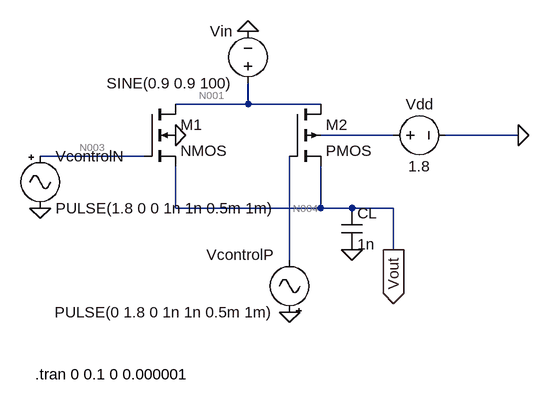
[diagram p0: schematic Lab 7 Fig 1c.asc]
Lab 7 Fig 1c.asc, the LTspice schematic file:
Version 4
SHEET 1 880 680
WIRE 224 112 224 80
WIRE 224 112 112 112
WIRE 336 112 224 112
WIRE 448 160 336 160
WIRE 640 160 528 160
WIRE 64 192 -96 192
WIRE 112 272 112 208
WIRE 336 272 336 208
WIRE 336 272 112 272
WIRE 384 272 336 272
WIRE 448 272 384 272
WIRE 448 336 448 272
WIRE 288 352 288 192
FLAG 224 0 0
FLAG 448 336 Vout
IOPIN 448 336 Out
FLAG -96 272 0
FLAG 288 432 0
FLAG 384 336 0
FLAG 112 160 0
FLAG 640 160 0
SYMBOL nmos4 64 112 R0
SYMATTR InstName M1
SYMBOL pmos4 288 112 R0
SYMATTR InstName M2
SYMBOL Misc\\signal -96 176 R0
WINDOW 123 0 0 Left 0
WINDOW 39 0 0 Left 0
SYMATTR InstName VcontrolN
SYMATTR Value PULSE(1.8 0 0 1n 1n 0.5m 1m)
SYMBOL Misc\\signal 288 448 R180
WINDOW 0 24 104 Left 2
WINDOW 3 24 16 Left 2
SYMATTR InstName VcontrolP
SYMATTR Value PULSE(0 1.8 0 1n 1n 0.5m 1m)
SYMBOL cap 368 272 R0
SYMATTR InstName CL
SYMATTR Value 1n
SYMBOL voltage 432 160 R270
WINDOW 0 32 56 VTop 2
WINDOW 3 -32 56 VBottom 2
SYMATTR InstName Vdd
SYMATTR Value 1.8
SYMBOL voltage 224 96 R180
WINDOW 0 24 96 Left 2
WINDOW 3 24 16 Left 2
SYMATTR InstName Vin
SYMATTR Value SINE(0.9 0.9 100)
TEXT -104 528 Left 2 !.tran 0 0.1 0 0.000001

The netlist it stands for:
* Lab 7 Fig 1c.asc
M1 N001 N003 Vout 0 NMOS
M2 N001 N004 Vout N002 PMOS
VcontrolN N003 0 PULSE(1.8 0 0 1n 1n 0.5m 1m)
VcontrolP 0 N004 PULSE(0 1.8 0 1n 1n 0.5m 1m)
CL Vout 0 1n
Vdd N002 0 1.8
Vin N001 0 SINE(0.9 0.9 100)
.model NMOS NMOS
.model PMOS PMOS
.lib standard.mos
.tran 0 0.1 0 0.000001
.backanno
.end

* Results of the author's LTspice run, read from the files saved beside the schematic
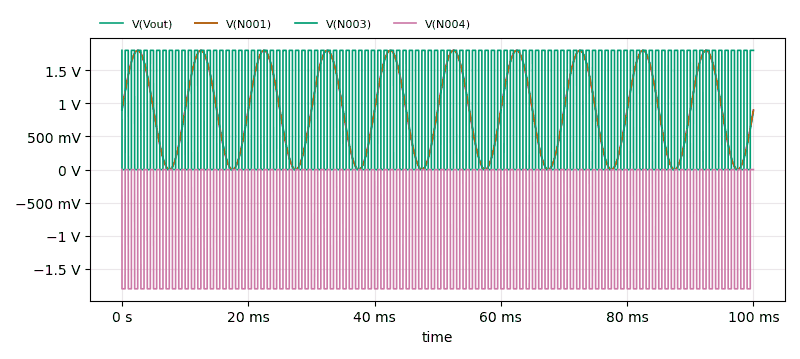
[diagram p1: Transient Analysis of Lab 7 Fig 1c.asc, plotted from the saved traces]
* Transient Analysis, 1 run:
*   V(Vout): min 273.8 µV, max 1.8 V, average 900 mV, rms 1.102 V, last 884.3 mV
*   V(N001): min 0 V, max 1.8 V, average 899.9 mV, rms 1.102 V, last 900 mV
*   V(N003): min 0 V, max 1.8 V, average 900 mV, rms 1.273 V, last 1.8 V
*   V(N004): min -1.8 V, max 0 V, average -900 mV, rms 1.273 V, last 0 V